# Altium schematic sheet FI2_BF998.SchDoc
size A4
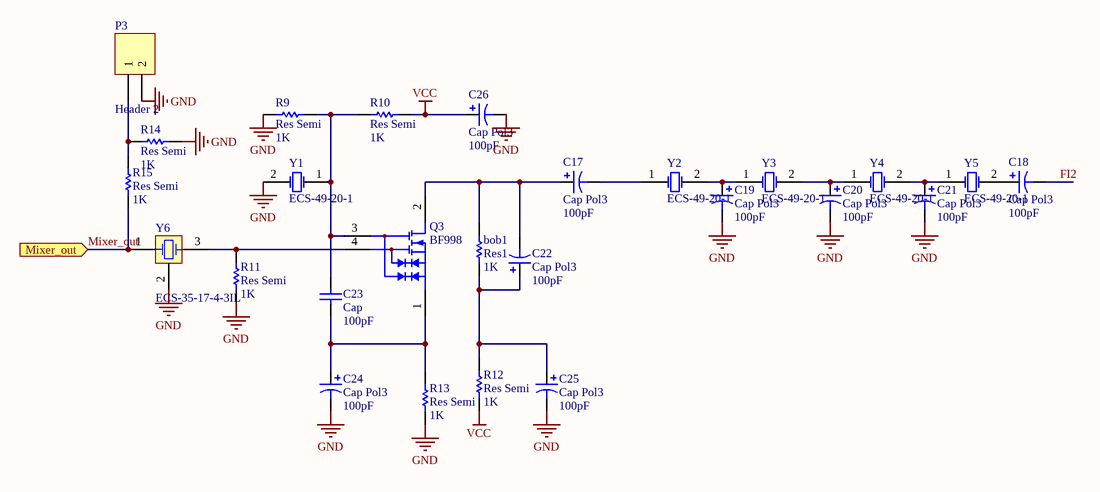
[diagram p0: FI2_BF998.SchDoc]

## Parts
bob1  Res1  value 1K  [AXIAL-0.3]
C17  Cap Pol3  value 100pF  [C0805]
C18  Cap Pol3  value 100pF  [C0805]
C19  Cap Pol3  value 100pF  [C0805]
C20  Cap Pol3  value 100pF  [C0805]
C21  Cap Pol3  value 100pF  [C0805]
C22  Cap Pol3  value 100pF  [C0805]
C23  Cap  value 100pF  [VP45-3.2]
C24  Cap Pol3  value 100pF  [C0805]
C25  Cap Pol3  value 100pF  [C0805]
C26  Cap Pol3  value 100pF  [C0805]
P3  Header 2  [HDR1X2]
Q3  BF998  [SOT143_N]
R9  Res Semi  value 1K  [2012[0805]]
R10  Res Semi  value 1K  [2012[0805]]
R11  Res Semi  value 1K  [2012[0805]]
R12  Res Semi  value 1K  [2012[0805]]
R13  Res Semi  value 1K  [2012[0805]]
R14  Res Semi  value 1K  [2012[0805]]
R15  Res Semi  value 1K  [2012[0805]]
Y1  ECS-49-20-1  [HC-49U]
Y2  ECS-49-20-1  [HC-49U]
Y3  ECS-49-20-1  [HC-49U]
Y4  ECS-49-20-1  [HC-49U]
Y5  ECS-49-20-1  [HC-49U]
Y6  ECS-35-17-4-3IL  [HC-49US]

## Ports
Mixer_out (in)

## Nets
GND: C19.2 C20.2 C21.2 C24.2 C25.2 C26.2 P3.2 R9.2 R11.1 R13.1 R14.1 Y1.2(OSC2) Y6.2(COM)
VCC: C26.1 R10.1 R12.1
FI2: C18.2
Mixer_out: R15.1 Y6.1(OSC1) ; port Mixer_out
Netbob1_1: bob1.1 C22.1 C25.1 R12.2
Netbob1_2: bob1.2 C17.1 C22.2 Q3.2(D)
NetC17_2: C17.2 Y2.1(OSC1)
NetC18_1: C18.1 Y5.2(OSC2)
NetC19_1: C19.1 Y2.2(OSC2) Y3.1(OSC1)
NetC20_1: C20.1 Y3.2(OSC2) Y4.1(OSC1)
NetC21_1: C21.1 Y4.2(OSC2) Y5.1(OSC1)
NetC23_1: C23.1 C24.1 Q3.1(S) R13.2
NetC23_2: C23.2 Q3.3(G2) R9.1 R10.2 Y1.1(OSC1)
NetP3_1: P3.1 R14.2 R15.2
NetQ3_4: Q3.4(G1) R11.2 Y6.3(OSC2)

## Library data of the parts
bob1 = Res1: Resistor; Published: 8-Jun-2000; LatestRevisionDate: 17-Jul-2002; LatestRevisionNote: Re-released for DXP Platform.; PackageReference: AXIAL-0.3; Publisher: Altium Limited
C17-C22 C24-C26 = Cap Pol3: Polarized Capacitor (Surface Mount); Published: 8-Jun-2000; LatestRevisionDate: 17-Jul-2002; LatestRevisionNote: Re-released for DXP Platform.; PackageReference: C0805; Publisher: Altium Limited
C23 = Cap: Capacitor; Published: 8-Jun-2000; LatestRevisionDate: 17-Jul-2002; LatestRevisionNote: Re-released for DXP Platform.; PackageReference: RAD-0.3; Publisher: Altium Limited
P3 = Header 2: Header, 2-Pin; LatestRevisionDate: 17-Jul-2002; LatestRevisionNote: Re-released for DXP Platform.; Publisher: Altium Limited
Q3 = BF998: Silicon N-channel Dual-gate MOSFET; Published: 17-Sep-2003; LatestRevisionDate: 12-Dec-2006; LatestRevisionNote: IPC-7351 Footprint Added.; DatasheetVersion: Aug-1996; PackageVersion: Sep-1996; PackageReference: SOT143; Publisher: Altium Limited; PackageDescription: 4-Pin SOT-143 Package 1.9 mm Pitch, 2.3 mm Lead Span; Code_IPC: SOT143; ComponentLink1Description: Manufacturer Link; ComponentLink1URL: http://www.semiconductors.philips.com/; ComponentLink2Description: Datasheet; ComponentLink2URL: http://www.semiconductors.philips.com/acrobat/datasheets/BF998_2.pdf
R9-R15 = Res Semi: Semiconductor Resistor; Published: 8-Jun-2000; LatestRevisionDate: 17-Jul-2002; LatestRevisionNote: Re-released for DXP Platform.; PackageReference: AXIAL-0.5; Publisher: Altium Limited
Y1-Y5 = ECS-49-20-1: Crystal Oscillator; Published: 17-Jul-2002; DatasheetDocument: 18-Apr-2000; PackageReference: HC-49U; Publisher: Altium Limited; ComponentLink1Description: Manufacturer Link; ComponentLink1URL: http://www.ecsxtal.com/; ComponentLink2Description: Datasheet; ComponentLink2URL: http://www.ecsxtal.com/pdf2/HC49U.PDF
Y6 = ECS-35-17-4-3IL: Crystal Oscillator, 3rd In-Line Lead Version; Published: 17-Jul-2002; DatasheetDocument: 18-Apr-2000; PackageReference: HC-49US; Publisher: Altium Limited; ComponentLink1Description: Manufacturer Link; ComponentLink1URL: http://www.ecsxtal.com/; ComponentLink2Description: Datasheet; ComponentLink2URL: http://www.ecsxtal.com/pdf3/HC_49US.pdf